# Altium schematic sheet IRS Half brigde.SchDoc
size A
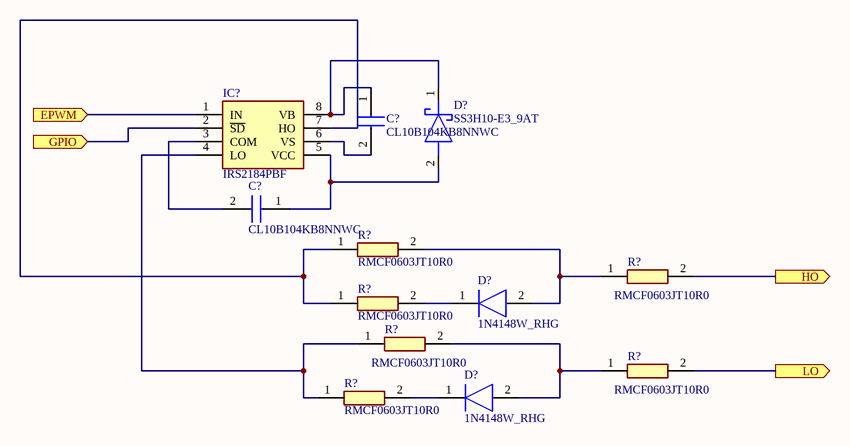
[diagram p0: IRS Half brigde.SchDoc]

## Parts
(Parts that share a designator on the sheet are numbered #1, #2 ... from top to bottom, then left to right.)
C?#1  CL10B104KB8NNWC  [CAPC1608X90N]
C?#2  CL10B104KB8NNWC  [CAPC1608X90N]
D?#1  SS3H10-E3_9AT  [DIOM7959X262N]
D?#2  1N4148W_RHG  [1N4148WRHG]
D?#3  1N4148W_RHG  [1N4148WRHG]
IC?  IRS2184PBF  [DIP762W56P254L988H533Q8N]
R?#1  RMCF0603JT10R0  [RESC1608X55N]
R?#2  RMCF0603JT10R0  [RESC1608X55N]
R?#3  RMCF0603JT10R0  [RESC1608X55N]
R?#4  RMCF0603JT10R0  [RESC1608X55N]
R?#5  RMCF0603JT10R0  [RESC1608X55N]
R?#6  RMCF0603JT10R0  [RESC1608X55N]

## Ports
EPWM (in), GPIO (in), HO (out), LO (out)

## Nets
EPWM: IC?.1(IN) ; port EPWM
GPIO: IC?.2(~{SD}) ; port GPIO
HO: R?#2.2 ; port HO
LO: R?#5.2 ; port LO
NetC?#1_1: C?#1.1 D?#1.1(K) IC?.8(VB)
NetC?#1_2: C?#1.2 IC?.6(VS)
NetC?#2_1: C?#2.1 D?#1.2(A) IC?.5(VCC)
NetC?#2_2: C?#2.2 IC?.3(COM)
NetD?#2_1: D?#2.1(K) R?#3.2
NetD?#2_2: D?#2.2(A) R?#1.2 R?#2.1
NetD?#3_1: D?#3.1(K) R?#6.2
NetD?#3_2: D?#3.2(A) R?#4.2 R?#5.1
NetIC?_4: IC?.4(LO) R?#4.1 R?#6.1
NetIC?_7: IC?.7(HO) R?#1.1 R?#3.1

## Library data of the parts
C?#1 C?#2 = CL10B104KB8NNWC: Capacitor; Manufacturer_Name: Samsung Electro-Mechanics; Datasheet Link: http://www.samsungsem.com/kr/support/product-search/mlcc/CL10B104KB8NNWC.jsp; Height: 0.9mm; Manufacturer_Part_Number: CL10B104KB8NNWC; Mouser Part Number: 187-CL10B104KB8NNWC; Mouser Price/Stock: https://www.mouser.co.uk/ProductDetail/Samsung-Electro-Mechanics/CL10B104KB8NNWC?qs=EvNa9vf1TdYOAZGBJN%252BGRQ%3D%3D; Arrow Part Number: CL10B104KB8NNWC; Arrow Price/Stock: https://www.arrow.com/en/products/cl10b104kb8nnwc/samsung-electro-mechanics
D?#1 = SS3H10-E3_9AT: Schottky Diode; Manufacturer_Name: Vishay; Manufacturer_Part_Number: SS3H10-E3/9AT; Datasheet Link: https://componentsearchengine.com/Datasheets/2/SS3H10-E3_9AT.pdf; Height: 2.62mm; Mouser Part Number: 625-SS3H10-E3/9AT; Mouser Price/Stock: https://www.mouser.co.uk/ProductDetail/Vishay-General-Semiconductor/SS3H10-E3-9AT?qs=x2jpVgRnAtOgVt1hh%2FtmvQ%3D%3D; Arrow Part Number: SS3H10-E3/9AT; Arrow Price/Stock: https://www.arrow.com/en/products/ss3h10-e39at/vishay
D?#2 D?#3 = 1N4148W_RHG: Diode; Manufacturer_Name: Taiwan Semiconductor; Manufacturer_Part_Number: 1N4148W RHG; Datasheet Link: https://mouser.componentsearchengine.com/Datasheets/1/1N4148W RHG.pdf; Height: 1.15mm; Mouser Part Number: 821-1N4148WRHG; Mouser Price/Stock: https://www.mouser.co.uk/ProductDetail/Taiwan-Semiconductor/1N4148W-RHG?qs=KwaGCOX4wIag2YPLXylAvA%3D%3D; Arrow Part Number: 1N4148W RHG; Arrow Price/Stock: https://www.arrow.com/en/products/1n4148wrhg/taiwan-semiconductor?region=nac
IC? = IRS2184PBF: Integrated Circuit; Manufacturer_Name: Infineon; Datasheet Link: http://uk.rs-online.com/web/p/products/0456214; Height: 5.33mm; Manufacturer_Part_Number: IRS2184PBF; Mouser Part Number: 942-IRS2184PBF; Mouser Price/Stock: https://www.mouser.co.uk/ProductDetail/Infineon-Technologies/IRS2184PBF?qs=9%252BKlkBgLFf3%2F4k8XP8%252BWIw%3D%3D; Arrow Part Number: IRS2184PBF; Arrow Price/Stock: https://www.arrow.com/en/products/irs2184pbf/infineon-technologies-ag?region=nac
R?#1-R?#6 = RMCF0603JT10R0: Resistor; Manufacturer_Name: Stackpole Electronics Inc.; Datasheet Link: https://www.seielect.com/catalog/sei-rmcf_rmcp.pdf; Height: 0.55mm; Manufacturer_Part_Number: RMCF0603JT10R0